# EAGLE schematic 183db (EAGLE 9.0.0)
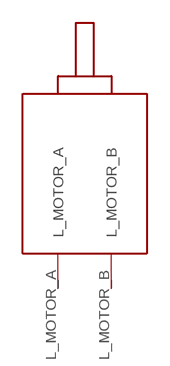
[diagram p0: schematic, sheet 1, part 1 of 2]
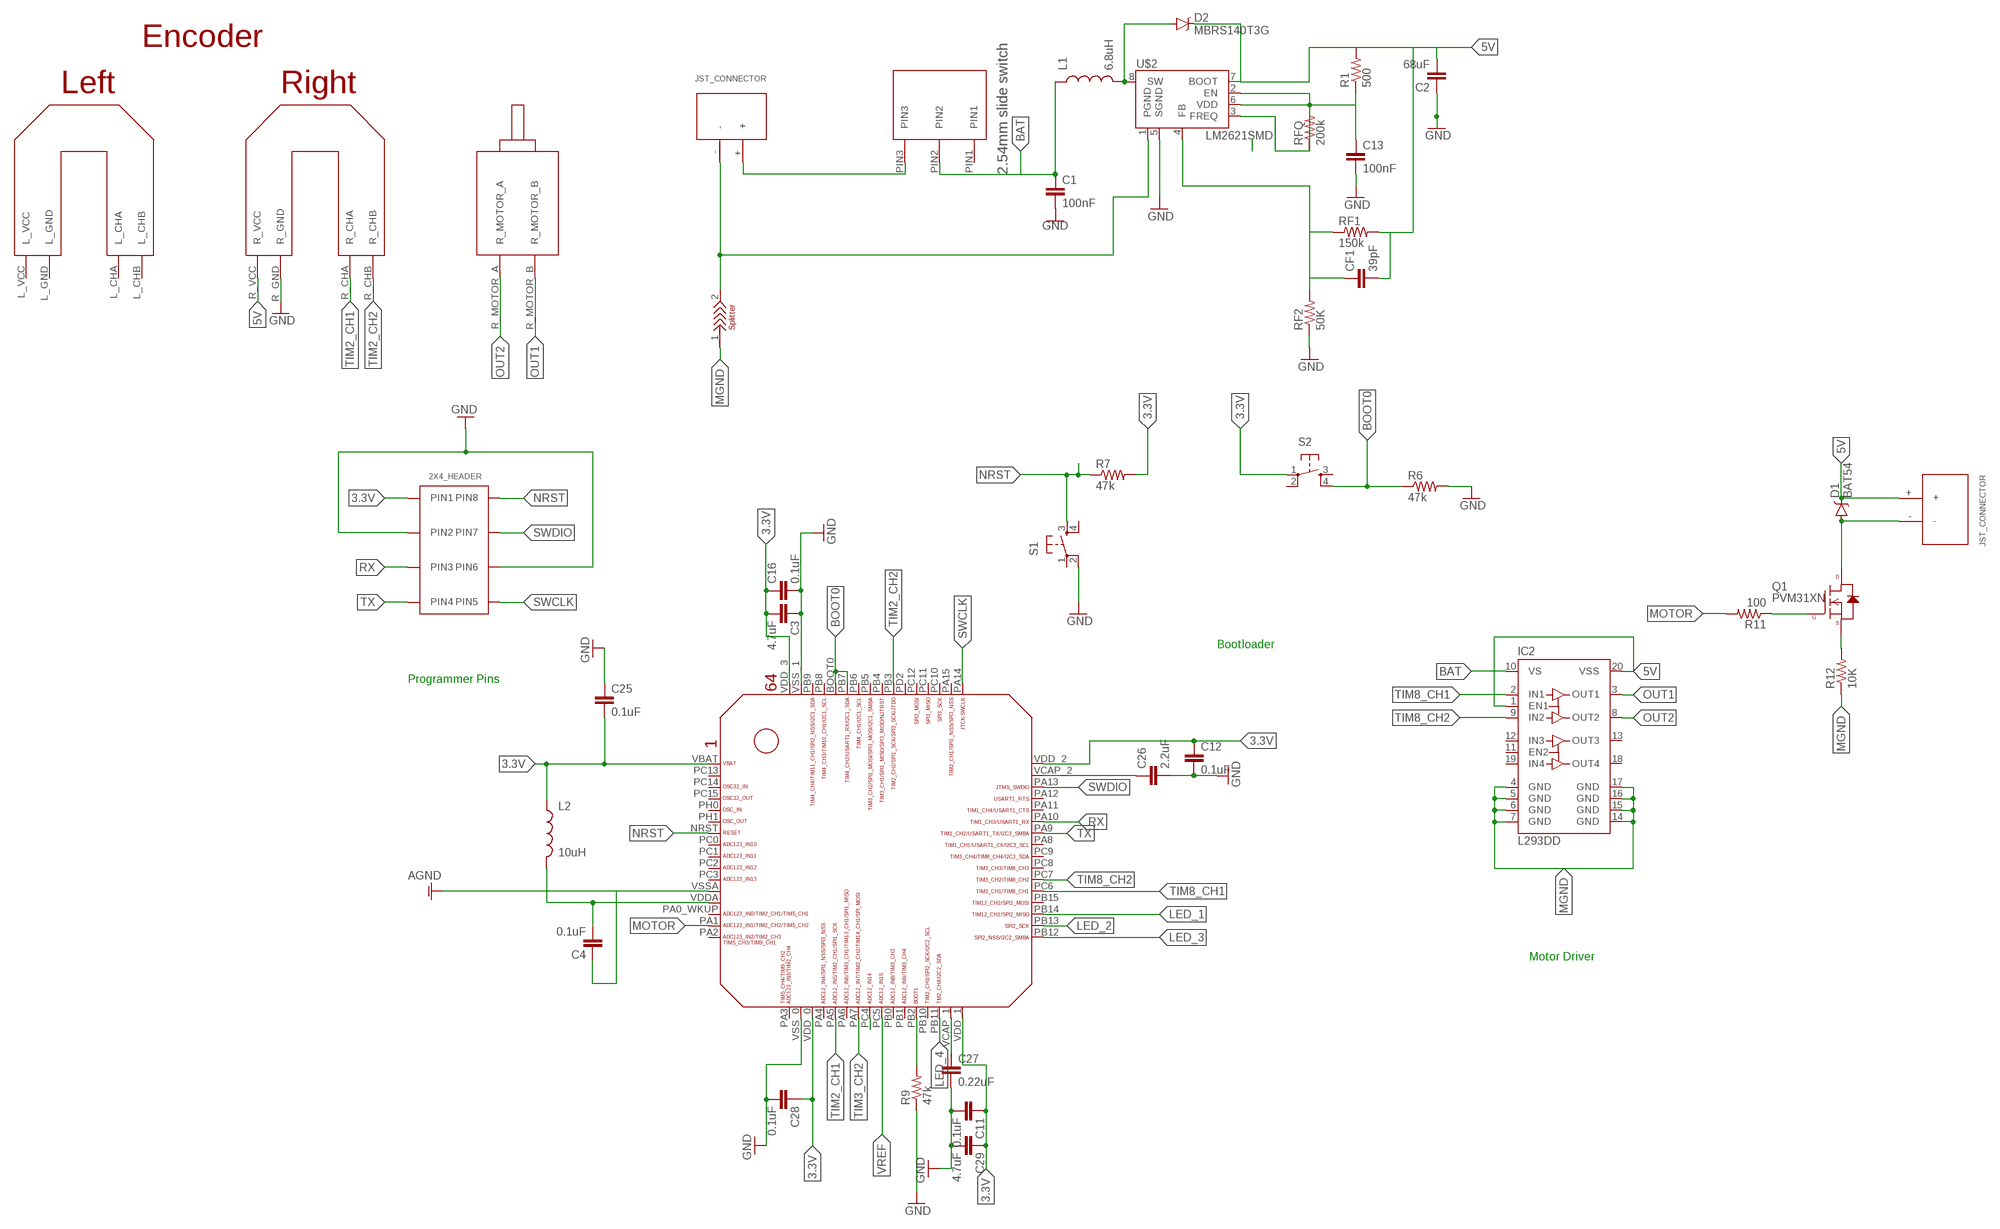
[diagram p1: schematic, sheet 1, part 2 of 2]

## Parts
C1  100nF  CAP0603-CAP  [0603-CAP]
C2  68uF  CAP0603-CAP  [0603-CAP]
C3  4.7uF  CAP0603-CAP  [0603-CAP]
C4  0.1uF  CAP0603-CAP  [0603-CAP]
C11  0.1uF  CAP0603-CAP  [0603-CAP]
C12  0.1uF  CAP0603-CAP  [0603-CAP]
C13  100nF  CAP0603-CAP  [0603-CAP]
C16  0.1uF  CAP0603-CAP  [0603-CAP]
C25  0.1uF  CAP0603-CAP  [0603-CAP]
C26  2.2uF  CAP0603-CAP  [0603-CAP]
C27  0.22uF  CAP0603-CAP  [0603-CAP]
C28  0.1uF  CAP0603-CAP  [0603-CAP]
C29  4.7uF  CAP0603-CAP  [0603-CAP]
CF1  39pF  CAP0603-CAP  [0603-CAP]
D1  BAT54  B340A  [SMA-DIODE]
D2  MBRS140T3G  B340A  [SMA-DIODE]
IC2  L293DD  [SO20]
L1  6.8uH  INDUCTOR0603  [0603]
L2  10uH  INDUCTOR0603  [0603]
MOTOR  Motor_Connector  JST_CONNECTOR_FEMALE  [JST_CONNECTOR_FEMALE]
Q1  PVM31XN  N-CHANNEL-MOSFET-BSS138  [SOT23-3]
R1  500  RESISTOR0402-RES  [0402-RES]
R6  47k  RESISTOR0603-RES  [0603-RES]
R7  47k  RESISTOR0603-RES  [0603-RES]
R9  47k  RESISTOR0603-RES  [0603-RES]
R11  100  RESISTOR0402-RES  [0402-RES]
R12  10K  RESISTOR0402-RES  [0402-RES]
RF1  150k  RESISTOR0402-RES  [0402-RES]
RF2  50K  RESISTOR0402-RES  [0402-RES]
RFQ  200k  RESISTOR0402-RES  [0402-RES]
S1  TAC_SWITCHSMD  [TACTILE_SWITCH_SMD]
S2  TAC_SWITCHSMD  [TACTILE_SWITCH_SMD]
U$1  2X3_HEADER  [2X3_HEADER]
U$2  LM2621SMD  [MSOP-8]
U$3  STM32F405/415_LQFP64  [STM32F405/415_LQFP64]
U$20  TS02_SWITCH  [TS02_SWITCH]
U$22  FUTURA_V1.0_MOTOR_MOUNT  [FUTURA_V1.0_MOTOT_MOUNT]
U$25  JST_CONNECTOR_FEMALE  [JST_CONNECTOR_FEMALE]
U$26  SPLITTER  [SPLITTER]

## Nets
3.3V: C3.2 C11.1 C12.1 C16.1 C25.2 C28.1 C29.1 L2.1 R7.2 S2.1 U$1.PIN1 U$3.VBAT U$3.VDD_0 U$3.VDD_1 U$3.VDD_2 U$3.VDD_3
5V: C2.2 CF1.2 D1.C D2.C IC2.1(EN1) IC2.20(VSS) MOTOR.+ R1.2 RF1.2 U$2.7(BOOT) U$22.R_VCC
AGND: C4.1 U$3.VSSA
BAT: C1.1 IC2.10(VS) L1.1 U$20.PIN2
BOOT0: R6.1 S2.4 U$3.BOOT0 U$3.PB7
GND: C1.2 C3.1 C11.2 C12.2 C13.2 C16.2 C25.1 C26.2 C27.2 C28.2 C29.2 R6.2 R9.1 RF2.1 S1.2 U$1.PIN2 U$1.PIN6 U$2.5(SGND) U$3.VSS_0 U$3.VSS_1 U$22.R_GND
LED_1: U$3.PB14
LED_2: U$3.PB13
LED_3: U$3.PB12
LED_4: U$3.PB11
MGND: IC2.4(GND) IC2.5(GND) IC2.6(GND) IC2.7(GND) IC2.14(GND) IC2.15(GND) IC2.16(GND) IC2.17(GND) R12.1 U$26.1
MOTOR: R11.2 U$3.PA1
N$1: U$20.PIN3 U$25.+
N$3: R9.2 U$3.PB2
N$4: C13.1 R1.1 RFQ.1 RFQ.2 U$2.2(EN) U$2.3(FREQ) U$2.6(VDD)
N$5: CF1.1 RF1.1 RF2.2 U$2.4(FB)
N$6: C26.1 U$3.VCAP_2
N$7: D1.A MOTOR.- Q1.3(D)
N$8: C4.2 L2.2 U$3.VDDA
N$9: C27.1 U$3.VCAP_1
N$10: C2.1 ; supply symbol labelled GND
N$11: D2.A L1.2 U$2.8(SW)
N$12: U$2.1(PGND) U$25.- U$26.2
N$13: Q1.2(S) R12.2
N$14: Q1.1(G) R11.1
NRST: R7.1 S1.3 U$1.PIN8 U$3.NRST
OUT1: IC2.3(OUT1) U$22.R_MOTOR_B
OUT2: IC2.8(OUT2) U$22.R_MOTOR_A
OUTZ: U$3.PC4
RX: U$1.PIN3 U$3.PA10
SWCLK: U$1.PIN5 U$3.PA14
SWDIO: U$1.PIN7 U$3.PA13
TIM2_CH1: U$3.PA5 U$22.R_CHA
TIM2_CH2: U$3.PB3 U$22.R_CHB
TIM3_CH2: U$3.PA7
TIM8_CH1: IC2.2(IN1) U$3.PC6
TIM8_CH2: IC2.9(IN2) U$3.PC7
TX: U$1.PIN4 U$3.PA9
VREF: U$3.PC5
Unconnected: IC2.11(EN2) IC2.12(IN3) IC2.13(OUT3) IC2.18(OUT4) IC2.19(IN4) S1.1 S1.4 S2.2 S2.3 U$3.PA0_WKUP(PA0_AKUP) U$3.PA2 U$3.PA3 U$3.PA4 U$3.PA6 U$3.PA8 U$3.PA11 U$3.PA12 U$3.PA15 U$3.PB0 U$3.PB1 U$3.PB4 U$3.PB5 U$3.PB6 U$3.PB8 U$3.PB9 U$3.PB10 U$3.PB15 U$3.PC0 U$3.PC1 U$3.PC2 U$3.PC3 U$3.PC8 U$3.PC9 U$3.PC10 U$3.PC11 U$3.PC12 U$3.PC13 U$3.PC14 U$3.PC15 U$3.PD2 U$3.PH0 U$3.PH1 U$20.PIN1 U$22.L_CHA U$22.L_CHB U$22.L_GND U$22.L_MOTOR_A U$22.L_MOTOR_B U$22.L_VCC

## Notes on the sheet
- Bootloader
- Programmer Pins
- Motor Driver

## Library data of the parts
C1-C4 C11-C13 C16 C25-C29 CF1 = SparkFun:CAP: Capacitor Standard 0603 ceramic capacitor, and 0.1" leaded capacitor.
D1 D2 = SparkFun-DiscreteSemi:B340A: Schottky Diode 3A-40V; PROD_ID: DIO-09886; VALUE: BA340A
IC2 = st-microelectronics:L293DD: PUSH-PULL FOUR CHANNEL DRIVER WITH DIODES Source: http://www.st.com/stonline/books/pdf/docs/1330.pdf; OC_FARNELL: unknown
L1 L2 = SparkFun:INDUCTOR: Inductors Basic Inductor/Choke - 0603 and 1206. Footprints are not proven and vary greatly between part numbers.
MOTOR U$25 = JST_CONNECTOR_FEMALE. through hole:JST_CONNECTOR_FEMALE
Q1 = GeekAmmo:N-CHANNEL-MOSFET: N-Channel MOSFET Mode Field Effect Transistor; DATASHEET: http://www.fairchildsemi.com/ds/BS/BSS138.pdf; DIGIKEY: BSS138TR-ND; ELEMENT14: 2323154; URL: http://au.element14.com/fairchild-semiconductor/bss138/mosfet-n-ch-50v-220ma-sot-23/dp/2323154
R1 R11 R12 RF1 RF2 RFQ = SparkFun-Passives:RESISTOR: Resistor Basic schematic elements and footprints for 0603, 1206, and PTH resistors.
R6 R7 R9 = SparkFun:RESISTOR: Resistor Basic schematic elements and footprints for 0603, 1206, and PTH resistors.
S1 S2 = SparkFun:TAC_SWITCH: Momentary Switch Button commonly used for reset or general input. Spark Fun Electronics SKU : COM-00097
U$1 = 2X4_HEADER:2X3_HEADER
U$2 = SparkFun:LM2621
U$3 = STM32F10x F4xx:STM32F405/415_LQFP64
U$20 = 2.54mm slide switch:TS02_SWITCH
U$22 = Futura 1.0 motor mount template:FUTURA_V1.0_MOTOR_MOUNT
U$26 = splitter:SPLITTER